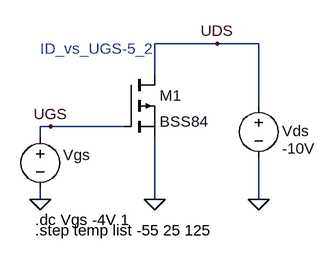
[diagram p0: schematic ID_vs_UGS-5_2.asc]
ID_vs_UGS-5_2.asc, the LTspice schematic file:
Version 4
SHEET 1 1292 680
WIRE -624 -176 -720 -176
WIRE -560 -176 -624 -176
WIRE -720 -128 -720 -176
WIRE -560 -80 -560 -176
WIRE -880 -48 -896 -48
WIRE -768 -48 -880 -48
WIRE -896 -32 -896 -48
WIRE -896 64 -896 48
WIRE -720 64 -720 -32
WIRE -560 64 -560 0
FLAG -560 64 0
FLAG -896 64 0
FLAG -720 64 0
FLAG -880 -48 UGS
FLAG -624 -176 UDS
SYMBOL voltage -560 -96 R0
WINDOW 123 0 0 Left 2
WINDOW 39 37 60 Left 2
WINDOW 0 36 55 Left 2
WINDOW 3 36 82 Left 2
SYMATTR InstName Vds
SYMATTR Value -10V
SYMBOL voltage -896 -48 R0
WINDOW 123 0 0 Left 2
WINDOW 39 40 53 Left 2
WINDOW 3 -97 181 Left 2
WINDOW 0 35 44 Left 2
SYMATTR Value ""
SYMATTR InstName Vgs
SYMBOL pmos -768 -128 R0
SYMATTR InstName M1
SYMATTR Value BSS84
TEXT -904 96 Left 2 !.dc Vgs -4V 1
TEXT -904 112 Left 2 !.step temp list -55 25 125
TEXT -896 -168 Left 2 ;ID_vs_UGS-5_2

The netlist it stands for:
* ID_vs_UGS-5_2.asc
Vds UDS 0 -10V
Vgs UGS 0
M1 UDS UGS 0 0 BSS84
.model NMOS NMOS
.model PMOS PMOS
.lib standard.mos
.dc Vgs -4V 1
.step temp list -55 25 125
* ID_vs_UGS-5_2
.backanno
.end